# EasyEDA schematic design.json
TITLE: autostirrer; REV: 1.0; Date: 2024-05-07; Sheet: 1/1; Drawn By: vracto; Company: autostirrer
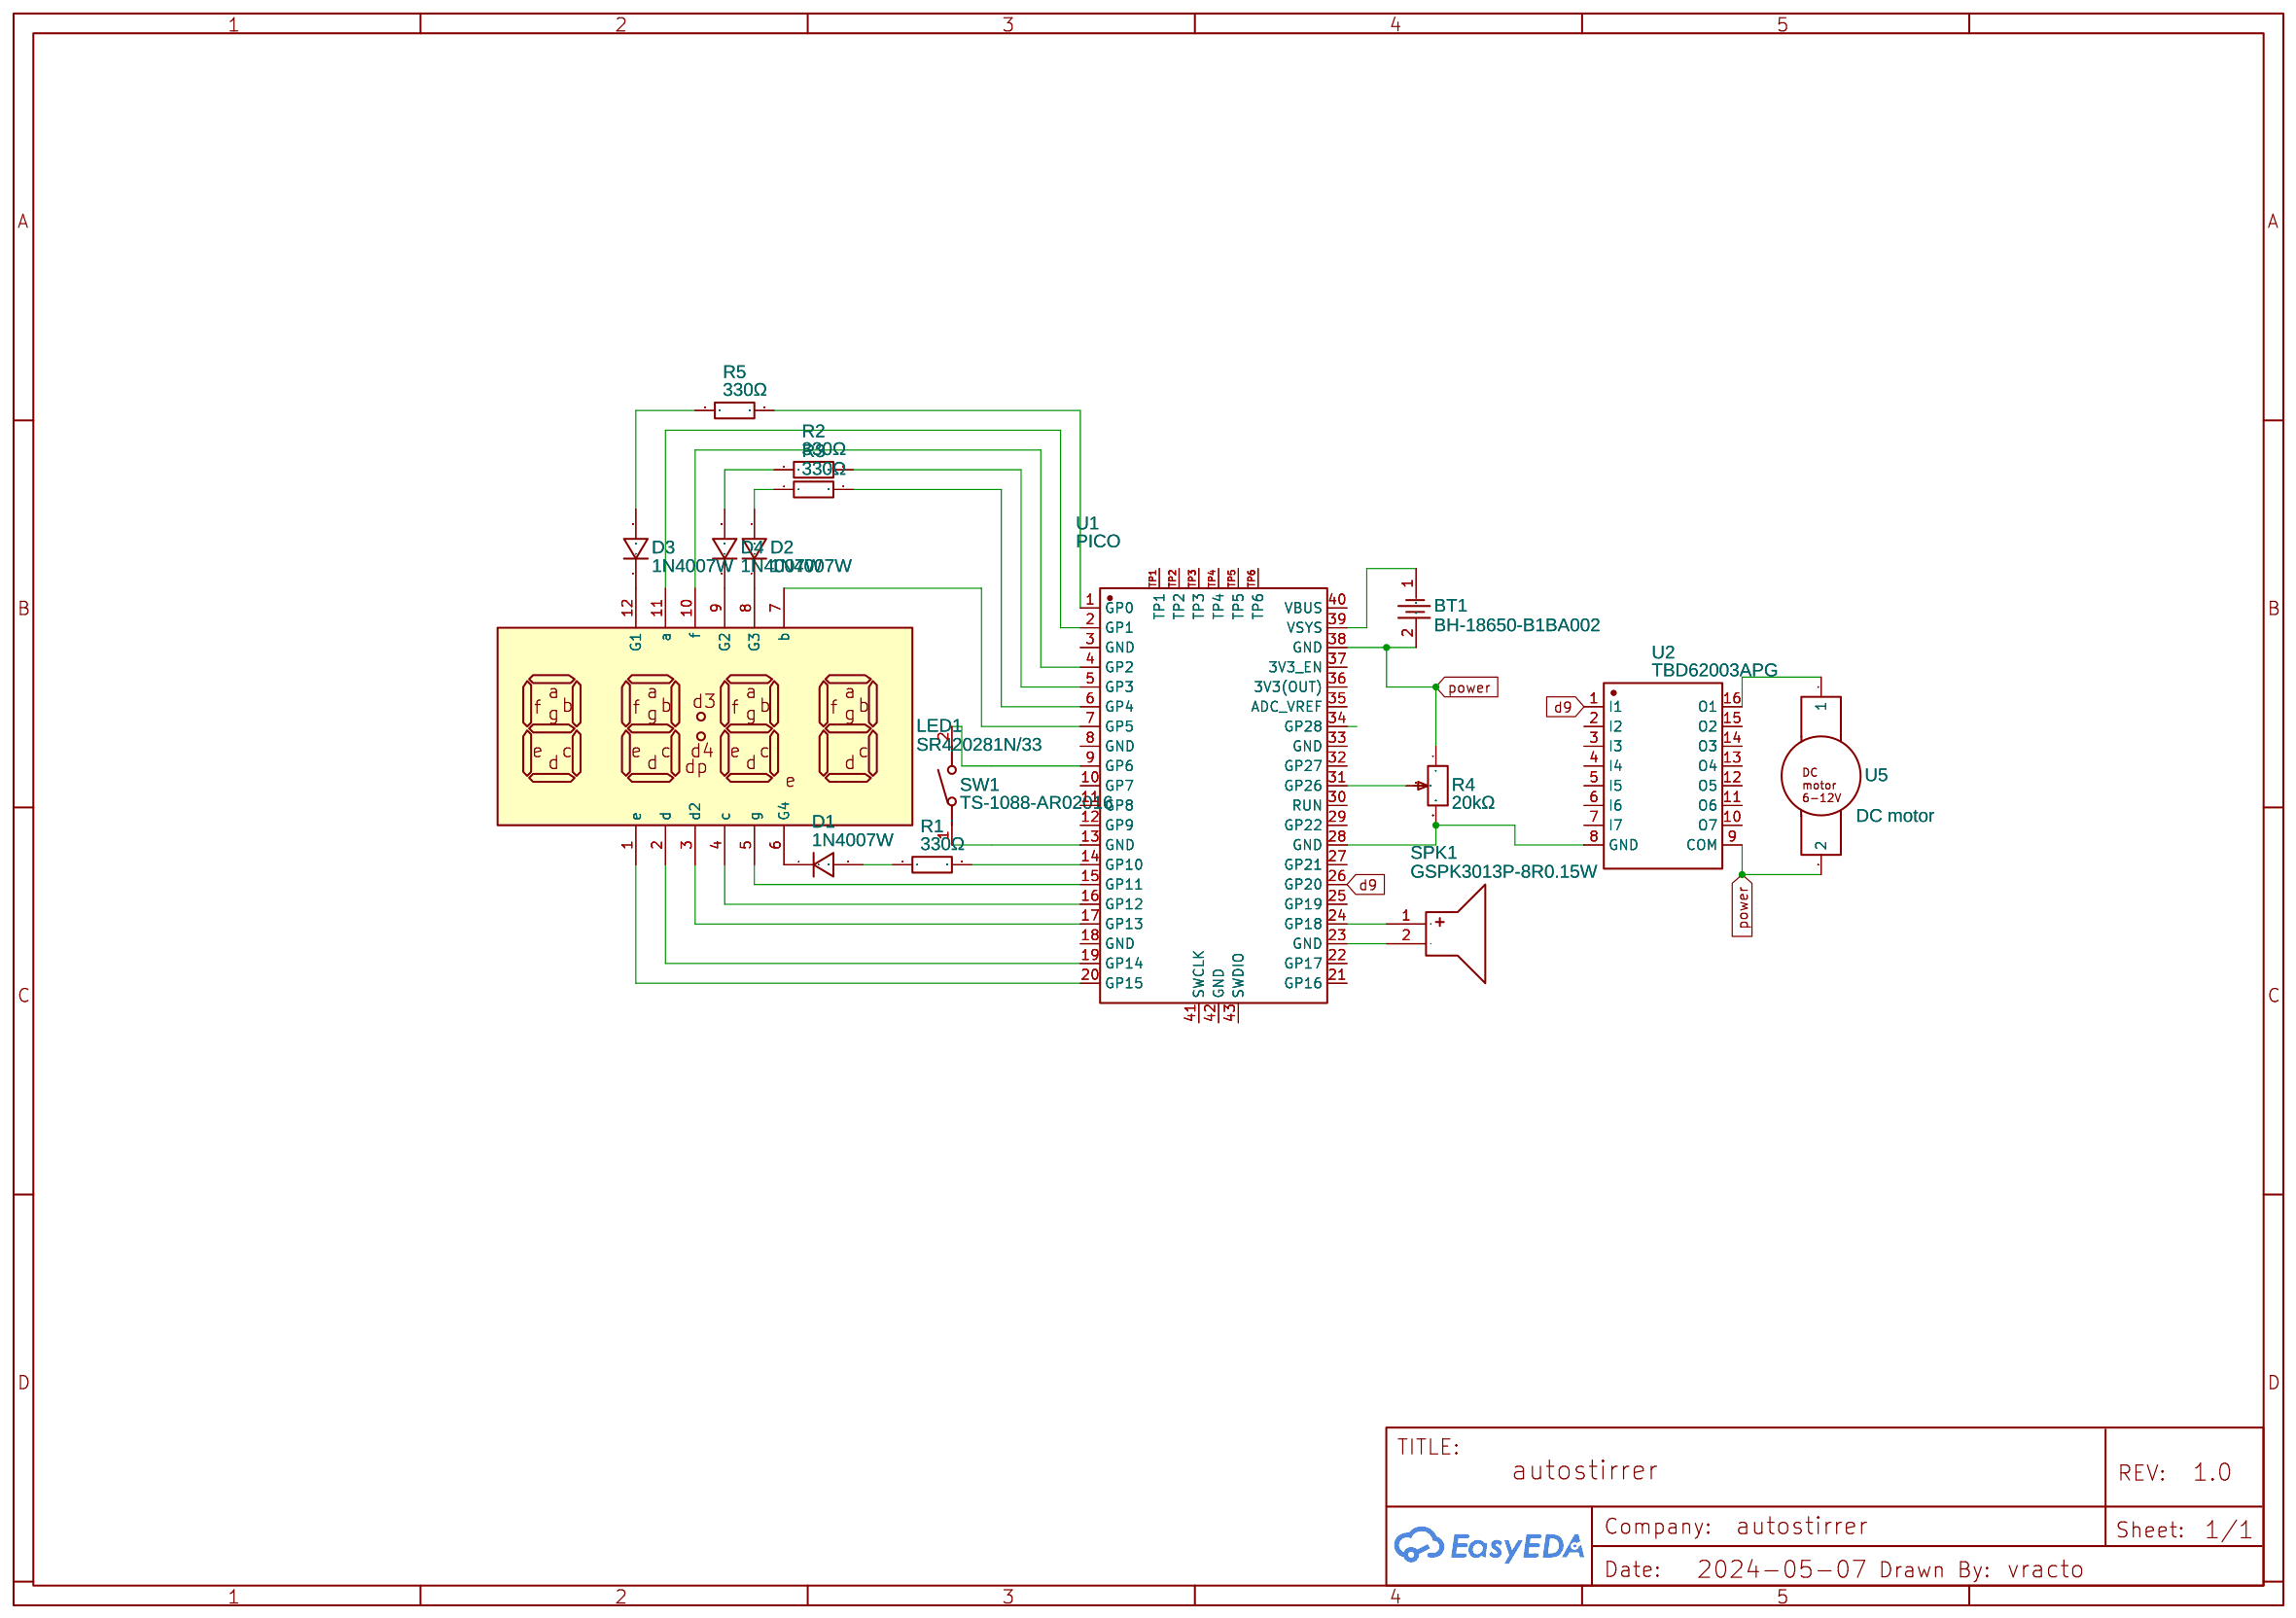
[diagram p0: schematic sheet]

## Parts
BT1  BH-18650-B1BA002  [BATTERY-SMD_18650-1S-L77.1-W20.7-1]
D1  1N4007W  [SOD-123_L2.8-W1.8-LS3.7-RD]
D2  1N4007W  [SOD-123_L2.8-W1.8-LS3.7-RD]
D3  1N4007W  [SOD-123_L2.8-W1.8-LS3.7-RD]
D4  1N4007W  [SOD-123_L2.8-W1.8-LS3.7-RD]
LED1  SR420281N/33  [LED-SEG-TH_12P-L32.1-W10.0-P2.54-S7.62-BL]
R1  330Ω  [RES-TH_BD2.2-L6.5-P10.50-D0.6]
R2  330Ω  [RES-TH_BD2.2-L6.5-P10.50-D0.6]
R3  330Ω  [RES-TH_BD2.2-L6.5-P10.50-D0.6]
R4  20kΩ  [RES-ADJ-TH_3P-L10.0-W10.0-P2.50-BL-BS]
R5  330Ω  [RES-TH_BD2.2-L6.5-P10.50-D0.6]
SPK1  GSPK3013P-8R0.15W  [SPK-TH_BD30.0-P15.00-D0.8-L-RD]
SW1  TS-1088-AR02016  [SW-SMD_L3.9-W3.0-P4.45]
U1  PICO  [COMM-SMD_L51.0-W21.0-P2.54_SC0916]
U2  TBD62003APG  [DIP-16_L19.8-W6.5-P2.54-LS7.6-BL]
U5  DC motor  [MOTOR1]

## Library data of the parts
BT1 = BH-18650-B1BA002: Contributor: lcsc; Supplier: LCSC; Supplier Part: C2988620; Manufacturer: MYOUNG(美阳); JLCPCB Part Class: Extended Part
D1-D4 = 1N4007W: Supplier: LCSC; Supplier Part: C328592; Manufacturer: BLUE ROCKET; Contributor: LCEDA_Lib
LED1 = SR420281N/33: Contributor: LCSC; Supplier: LCSC; Supplier Part: C252224; Manufacturer: ARKLED(方舟); Manufacturer Part: SR420281N; JLCPCB Part Class: Extended Part
R1-R3 R5 = MFR-25FTE52-330R: Contributor: LCSC; Supplier: LCSC; Manufacturer: YAGEO(国巨); Supplier Part: C138208; JLCPCB Part Class: Extended Part
R4 = 3296W-1-203LF: Resistance(Ohms): 20K; Supplier: LCSC; Manufacturer: BOURNS; Supplier Part: C34845; JLCPCB Part Class: Extended Part
SPK1 = GSPK3013P-8R0.15W: Contributor: LCSC; Supplier: LCSC; Supplier Part: C530533; Manufacturer: INGHAi(赢海); JLCPCB Part Class: Extended Part
SW1 = TS-1088-AR02016: Contributor: LCSC; Supplier: LCSC; Supplier Part: C720477; Manufacturer: XUNPU(讯普); JLCPCB Part Class: Extended Part
U1 = PICO: Supplier: LCSC; Supplier Part: C7203002; Manufacturer: Raspberry Pi(树莓派); JLCPCB Part Class: Extended Part; Contributor: lcsc
U2 = TBD62003APG: Contributor: LCSC; Supplier: LCSC; Manufacturer: TOSHIBA(东芝); Manufacturer Part: TBD62003APG(Z,HZ); Supplier Part: C146373; JLCPCB Part Class: Extended Part
U5 = -: Contributor: danielagrell.1; Manufacturer Part: ?

## Nets
d9: U1.26(GP20) U2.1(I1)
power: BT1.2 R4.1 U1.38(GND) U2.9(COM) U5.2
Net-(BT1-1): BT1.1 U1.39(VSYS)
Net-(D1-1): D1.1 LED1.6(G4)
Net-(D1-2): D1.2 R1.1
Net-(D2-1): D2.1 LED1.8(G3)
Net-(D2-2): D2.2 R3.1
Net-(D3-1): D3.1 LED1.12(G1)
Net-(D3-2): D3.2 R5.1
Net-(D4-1): D4.1 LED1.9(G2)
Net-(D4-2): D4.2 R2.1
Net-(LED1-1): LED1.1(e) U1.20(GP15)
Net-(LED1-2): LED1.2(d) U1.19(GP14)
Net-(LED1-3): LED1.3(d2) U1.17(GP13)
Net-(LED1-4): LED1.4(c) U1.16(GP12)
Net-(LED1-5): LED1.5(g) U1.15(GP11)
Net-(LED1-7): LED1.7(b) U1.7(GP5)
Net-(LED1-10): LED1.10(f) U1.4(GP2)
Net-(LED1-11): LED1.11(a) U1.2(GP1)
Net-(R1-2): R1.2 U1.14(GP10)
Net-(R2-2): R2.2 U1.5(GP3)
Net-(R3-2): R3.2 U1.6(GP4)
Net-(R4-2): R4.2 U1.31(GP26)
Net-(R4-3): R4.3 U1.28(GND) U2.8(GND)
Net-(R5-2): R5.2 U1.1(GP0)
Net-(SPK1-1): SPK1.1(+) U1.24(GP18)
Net-(SPK1-2): SPK1.2(-) U1.23(GND)
Net-(SW1-1): SW1.1 U1.13(GND)
Net-(SW1-2): SW1.2 U1.9(GP6)
Net-(U2-16): U2.16(O1) U5.1

Not connected (* = marked no-connect by the designer): U1 3(GND) 8(GND) 10(GP7) 11(GP8) 12(GP9) 18(GND) 21(GP16) 22(GP17) 25(GP19) 27(GP21) 29(GP22) 30(RUN) 32(GP27) 33(GND) 34(GP28) 35(ADC_VREF) 36(3V3(OUT)) 37(3V3_EN) 40(VBUS) 41(SWCLK) 42(GND) 43(SWDIO) TP1 TP2 TP3 TP4 TP5 TP6; U2 2(I2) 3(I3) 4(I4) 5(I5) 6(I6) 7(I7) 10(O7) 11(O6) 12(O5) 13(O4) 14(O3) 15(O2)
